# EAGLE design VS1053-PCB (EAGLE 7.7.0)
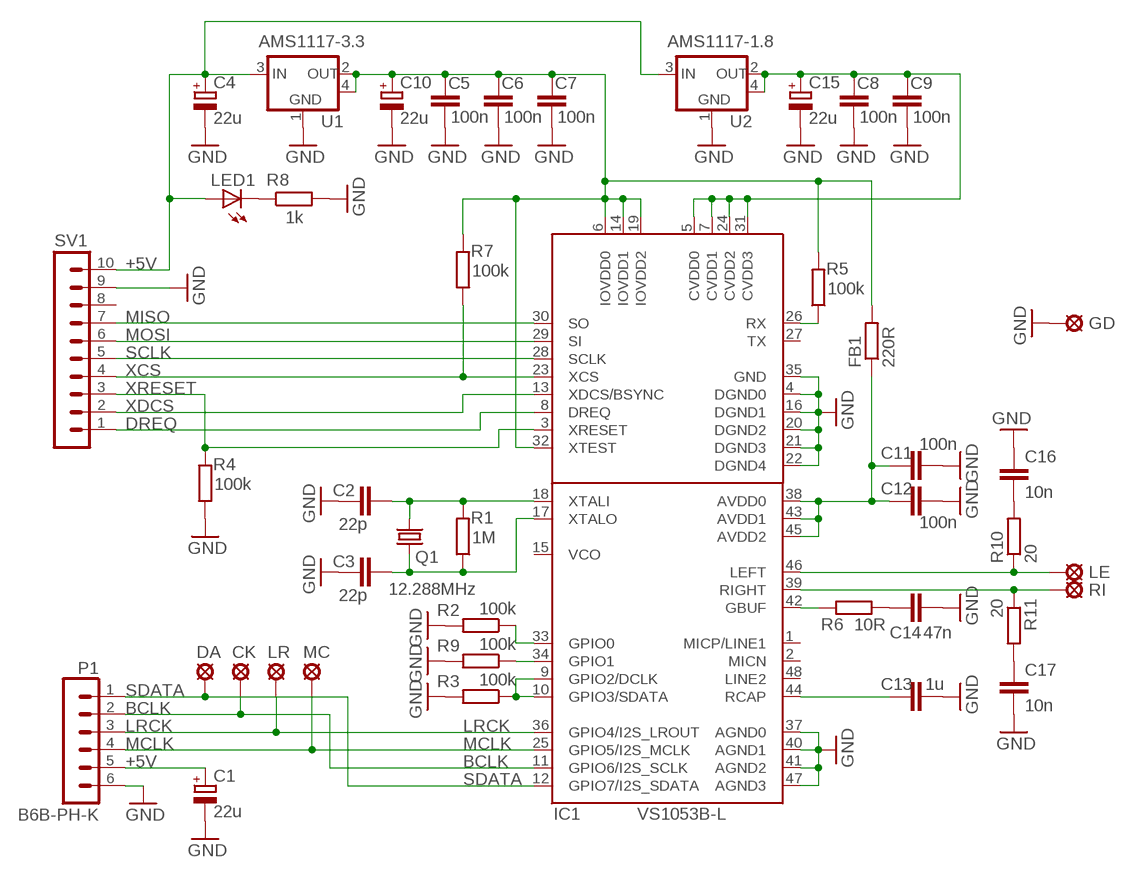
[diagram p0: schematic, sheet 1]

## Parts
C1  22u  CPOL-EUCT3528  [CT3528]
C2  22p  C-EUC0805  [C0805]
C3  22p  C-EUC0805  [C0805]
C4  22u  CPOL-EUCT3528  [CT3528]
C5  100n  C-EUC0805  [C0805]
C6  100n  C-EUC0805  [C0805]
C7  100n  C-EUC0805  [C0805]
C8  100n  C-EUC0805  [C0805]
C9  100n  C-EUC0805  [C0805]
C10  22u  CPOL-EUCT3528  [CT3528]
C11  100n  C-EUC0805  [C0805]
C12  100n  C-EUC0805  [C0805]
C13  1u  C-EUC0805  [C0805]
C14  47n  C-EUC0805  [C0805]
C15  22u  CPOL-EUCT3528  [CT3528]
C16  10n  C-EUC0603  [C0603]
C17  10n  C-EUC0603  [C0603]
CK  SOLPAD-MINI  [SOLPAD-MINI]
DA  SOLPAD-MINI  [SOLPAD-MINI]
FB1  220R  R-EU_R0805  [R0805]
GD  LSP10-ROUND  [LSP10-ROUND]
IC1  VS1053B-L  [QFP50P900X900X160-48N]
LE  LSP10-ROUND  [LSP10-ROUND]
LED1  LEDCHIPLED_0805  [CHIPLED_0805]
LR  SOLPAD-MINI  [SOLPAD-MINI]
MC  SOLPAD-MINI  [SOLPAD-MINI]
P1  B6B-PH-K  [B6B-PH-K]
Q1  12.288MHz  CRYSTALHC49S  [HC49/S]
R1  1M  R-EU_R0805  [R0805]
R2  100k  R-EU_R0805  [R0805]
R3  100k  R-EU_R0805  [R0805]
R4  100k  R-EU_R0805  [R0805]
R5  100k  R-EU_R0805  [R0805]
R6  10R  R-EU_R0805  [R0805]
R7  100k  R-EU_R0805  [R0805]
R8  1k  R-EU_R0805  [R0805]
R9  100k  R-EU_R0805  [R0805]
R10  20  R-EU_R0603  [R0603]
R11  20  R-EU_R0603  [R0603]
RI  LSP10-ROUND  [LSP10-ROUND]
SV1  MA10-1-THIN  [MA10-1-THIN]
U1  AMS1117-3.3  LT1117-S  [SOT223]
U2  AMS1117-1.8  LT1117-S  [SOT223]

## Nets
3.3VA: C11.1 C12.1 FB1.1 IC1.38(AVDD0) IC1.43(AVDD1) IC1.45(AVDD2)
+1.8V: C8.1 C9.1 C15.+ IC1.5(CVDD0) IC1.7(CVDD1) IC1.24(CVDD2) IC1.31(CVDD3) U2.2(OUT) U2.4(TAB)
+3.3V: C5.1 C6.1 C7.1 C10.+ FB1.2 IC1.6(IOVDD0) IC1.14(IOVDD1) IC1.19(IOVDD2) IC1.32(XTEST) R5.2 R7.2 U1.2(OUT) U1.4(TAB)
+5V: C1.+ C4.+ LED1.A P1.5 SV1.10 U1.3(IN) U2.3(IN)
BCLK: CK.1(SOLPAD) IC1.11(GPIO6/I2S_SCLK) P1.2
DREQ: IC1.8(DREQ) SV1.1
GND: C1.- C2.1 C3.1 C4.- C5.2 C6.2 C7.2 C8.2 C9.2 C10.- C11.2 C12.2 C13.2 C14.2 C15.- C16.1 C17.2 GD.MP(SOLPAD) IC1.4(DGND0) IC1.16(DGND1) IC1.20(DGND2) IC1.21(DGND3) IC1.22(DGND4) IC1.35(GND) IC1.37(AGND0) IC1.40(AGND1) IC1.41(AGND2) IC1.47(AGND3) P1.6 R2.2 R3.2 R4.1 R8.2 R9.2 SV1.9 U1.1(GND) U2.1(GND)
LRCK: IC1.36(GPIO4/I2S_LROUT) LR.1(SOLPAD) P1.3
MCLK: IC1.25(GPIO5/I2S_MCLK) MC.1(SOLPAD) P1.4
MISO: IC1.30(SO) SV1.7
MOSI: IC1.29(SI) SV1.6
N$1: C2.2 IC1.18(XTALI) Q1.2 R1.2
N$2: C3.2 IC1.17(XTALO) Q1.1 R1.1
N$3: IC1.9(GPIO2/DCLK) IC1.10(GPIO3/SDATA) R3.1
N$4: IC1.33(GPIO0) R2.1
N$5: IC1.42(GBUF) R6.1
N$6: C13.1 IC1.44(RCAP)
N$7: C14.1 R6.2
N$8: IC1.39(RIGHT) R11.1 RI.MP(SOLPAD)
N$9: IC1.26(RX) R5.1
N$10: IC1.46(LEFT) LE.MP(SOLPAD) R10.1
N$11: IC1.34(GPIO1) R9.1
N$12: LED1.C R8.1
N$13: C16.2 R10.2
N$14: C17.1 R11.2
SCLK: IC1.28(SCLK) SV1.5
SDATA: DA.1(SOLPAD) IC1.12(GPIO7/I2S_SDATA) P1.1
XCS: IC1.23(XCS) R7.1 SV1.4
XDCS: IC1.13(XDCS/BSYNC) SV1.2
XRESET: IC1.3(XRESET) R4.2 SV1.3
Unconnected: IC1.1(MICP/LINE1) IC1.2(MICN) IC1.15(VCO) IC1.27(TX) IC1.48(LINE2) SV1.8

## Library data of the parts
C1 C4 C10 C15 = rcl:CPOL-EU: POLARIZED CAPACITOR, European symbol
C2 C3 C5-C9 C11-C14 C16 C17 = rcl:C-EU: CAPACITOR, European symbol
CK DA LR MC = tj-library:SOLPAD-MINI
FB1 R1-R11 = rcl:R-EU_: RESISTOR, European symbol
GD LE RI = tj-library:LSP10-ROUND: SOLDER PAD round, drill 1.0 mm
IC1 = tj-library:VS1053B-L: VLSI, VS1053B-L 18bit-Audio Codec 48-Pin LQFP
LED1 = led:LED: LED OSRAM: - CHIPLED LG R971, LG N971, LY N971, LG Q971, LY Q971, LO R971, LY R971 LH N974, LH R974 LS Q976, LO Q976, LY Q976 LO Q996 - Hyper CHIPLED LW Q18S LB Q993, LB Q99A, LB R99A - SideLED LS A670, LO A670, LY A670, LG A670, LP A670 LB A673, LV A673, LT A673, LW A673 LH A674 LY A675 LS A676, LA A676, LO A676, LY A676, LW A676 LS A679, LY A679, LG A679 - Hyper Micro SIDELED® LS Y876, LA Y876, LO Y876, LY Y876 LT Y87S - SmartLED LW L88C, LW L88S LB L89C, LB L89S, LG L890 LS L89K, LO L89K, LY L89K LS L896, LA L896, LO L896, LY L896 - TOPLED LS T670, LO T670, LY T670, LG T670, LP T670 LSG T670, LSP T670, LSY T670, LOP T670, LYG T670 LG T671, LOG T671, LSG T671 LB T673, LV T673, LT T673, LW T673 LH T674 LS T676, LA T676, LO T676, LY T676, LB T676, LH T676, LSB T676, LW T676 LB T67C, LV T67C, LT T67C, LS T67K, LO T67K, LY T67K, LW E67C LS E67B, LA E67B, LO E67B, LY E67B, LB E67C, LV E67C, LT E67C LW T67C LS T679, LY T679, LG T679 LS T770, LO T770, LY T770, LG T770, LP T770 LB T773, LV T773, LT T773, LW T773 LH T774 LS E675, LA E675, LY E675, LS T675 LS T776, LA T776, LO T776, LY T776, LB T776 LHGB T686 LT T68C, LB T68C - Hyper Mini TOPLED® LB M676 - Mini TOPLED Santana® LG M470 LS M47K, LO M47K, LY M47K Source: http://www.osram.convergy.de LUXEON: - LUMILED® LXK2-PW12-R00, LXK2-PW12-S00, LXK2-PW14-U00, LXK2-PW14-V00 LXK2-PM12-R00, LXK2-PM12-S00, LXK2-PM14-U00 LXK2-PE12-Q00, LXK2-PE12-R00, LXK2-PE12-S00, LXK2-PE14-T00, LXK2-PE14-U00 LXK2-PB12-K00, LXK2-PB12-L00, LXK2-PB12-M00, LXK2-PB14-N00, LXK2-PB14-P00, LXK2-PB14-Q00 LXK2-PR12-L00, LXK2-PR12-M00, LXK2-PR14-Q00, LXK2-PR14-R00 LXK2-PD12-Q00, LXK2-PD12-R00, LXK2-PD12-S00 LXK2-PH12-R00, LXK2-PH12-S00 LXK2-PL12-P00, LXK2-PL12-Q00, LXK2-PL12-R00 Source: www.luxeon.com KINGBRIGHT: KA-3528ASYC Source: www.kingbright.com
P1 = tj-library:B6B-PH-K: JST PH2.0 Male HEADER 6-Pin
Q1 = crystal:CRYSTAL: CRYSTAL; OC_FARNELL: 1667008; OC_NEWARK: unknown
SV1 = tj-library:MA10-1-THIN: PIN HEADER
U1 U2 = v-reg:LT1117: 800mA LDO Positive Regulator Fixed 2.85V, 3.3V, 5V

## Net classes
0 default: width 0.254 mm, drill 0.305 mm, clearance 0.152 mm

## Board
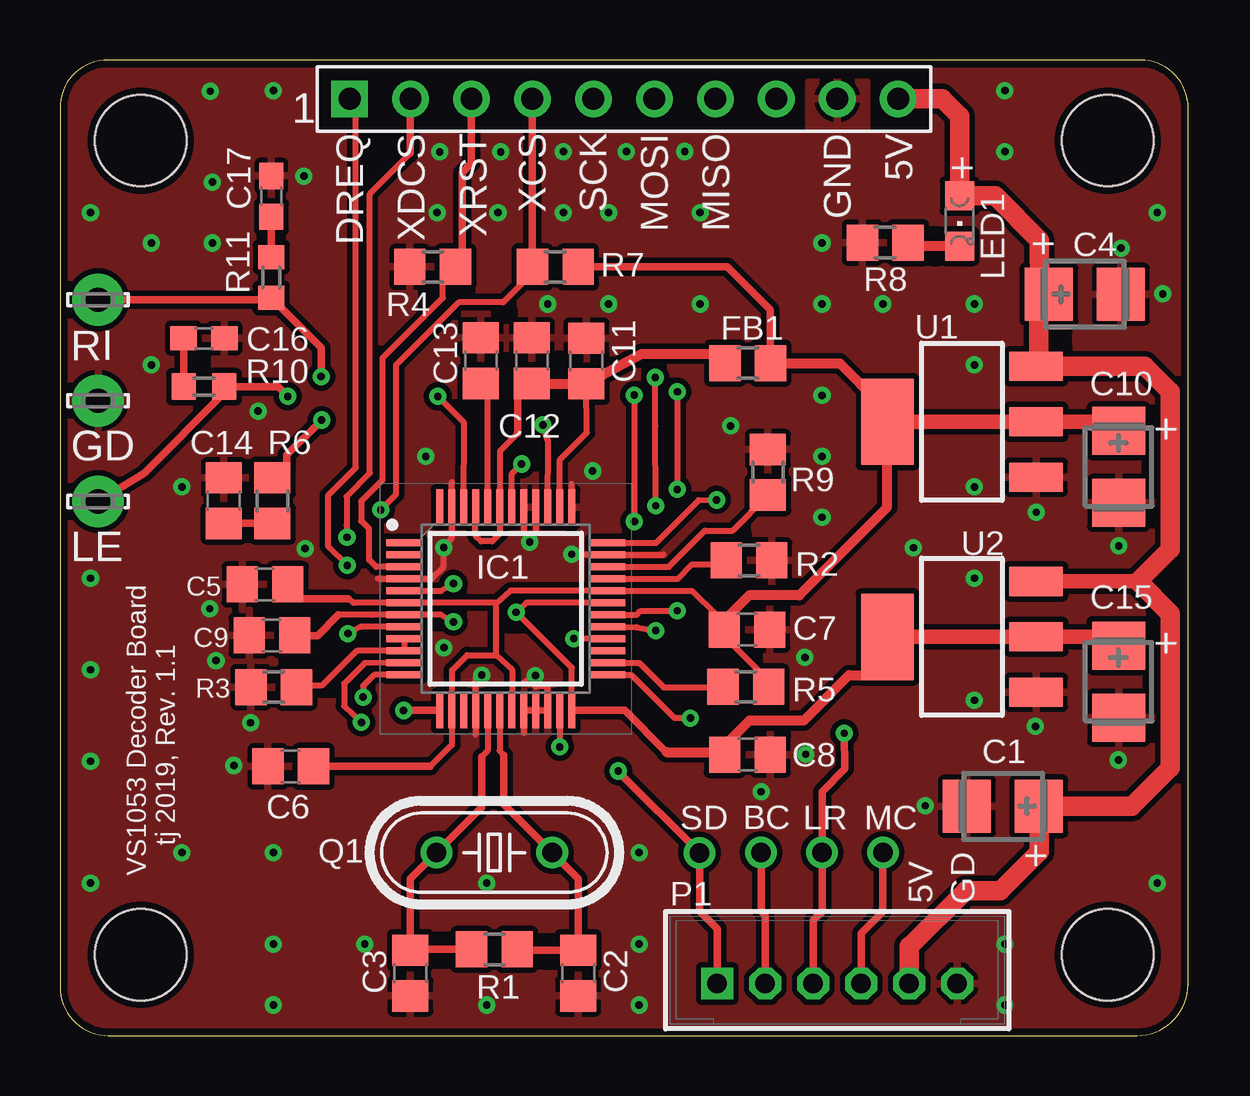
[diagram p1: board, top side]
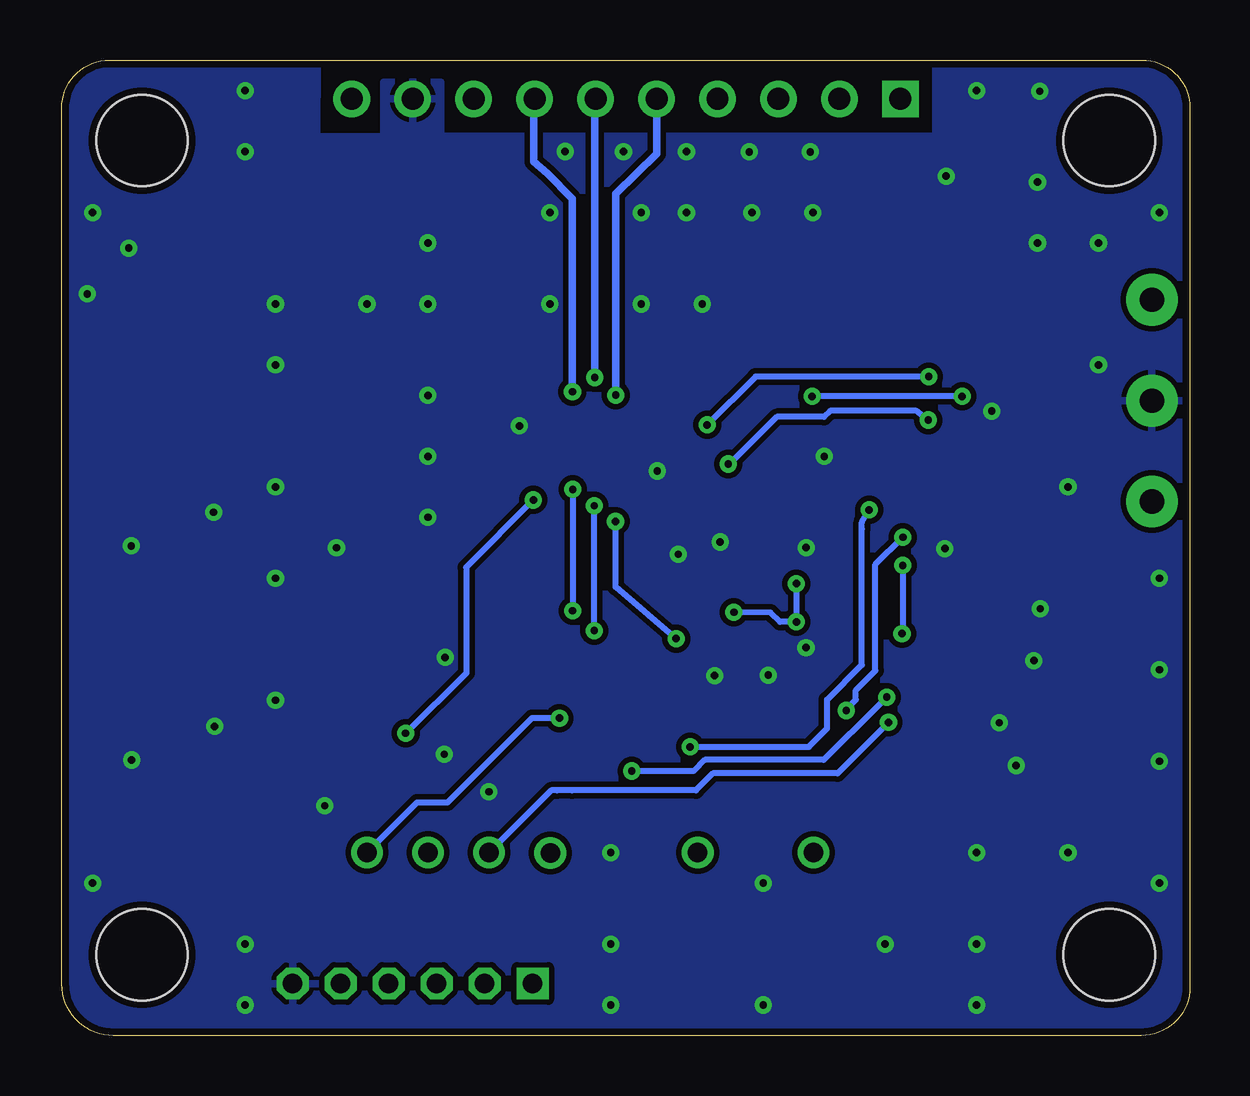
[diagram p2: board, bottom side, seen from below]

Size 47 x 40.65 mm. Coordinates in mm from the lower left corner, seen from the top.
Outline: 47,2.14 47,38.83 arc90 44.83,40.64 2.18,40.64 arc90 0,38.82 0,2.02 arc90 2.02,0 44.86,0 arc90 47,2.14
Copper layers (1*16): Top 0.035mm / dielectric 1.5mm / Bottom 0.035mm
Design rules "default *": minimum track width 8mil, minimum drill 12mil, track to track 6mil, track to pad 6mil, pad to pad 6mil, via to via 8mil, smd to smd 6mil, copper to edge 12mil, drill to drill 8mil, minimum pad ring 10mil, minimum via ring 8mil, stop-mask expansion 4mil, vias tented up to drill 12mil, thermal gap 8mil
Holes 3.81 mm at 3.37,3.37 43.66,3.37 3.37,37.29 43.66,37.29
tRestrict: area 45.3,14.3 to 45.5,15.1; area 45.3,23.3 to 45.5,24.1; area 18.2,29.9 to 18.9,30.2; area 20.5,27.9 to 21.6,28.3; area 15.1,30.5 to 15.2,31.1; area 36.3,33.4 to 36.6,33.5; area 36.3,32.3 to 36.6,32.4; area 41.8,28.7 to 42,29.3; area 15.4,17.1 to 15.8,17.2; area 18.7,17 to 19.2,17.1; area 29,15.7 to 29.1,15.9; area 28.5,20.8 to 28.6,20.9; 10 more areas

### Footprints (pad centres in the part's own frame; a part is rotated, then mirrored left to right if it is on the bottom)
CT3528 = smd 2 x 2.2: + -1.5,0; - 1.5,0
C0805 = smd 1.3 x 1.5: 1 -0.95,0; 2 0.95,0
C0603 = smd 1.1 x 1: 1 -0.85,0; 2 0.85,0
SOLPAD-MINI = drill 0.813: 1 0,0
R0805 = smd 1.3 x 1.5: 1 -0.95,0; 2 0.95,0
LSP10-ROUND = drill 1.016 pad 2.159: MP 0,0
QFP50P900X900X160-48N = smd 1.475 x 0.3: 1 -4.238,2.75; 2 -4.238,2.25; 3 -4.238,1.75; 4 -4.238,1.25; 5 -4.238,0.75; 6 -4.238,0.25; 7 -4.238,-0.25; 8 -4.238,-0.75; 9 -4.238,-1.25; 10 -4.238,-1.75; 11 -4.238,-2.25; 12 -4.238,-2.75; 25 4.238,-2.75; 26 4.238,-2.25; 27 4.238,-1.75; 28 4.238,-1.25; 29 4.238,-0.75; 30 4.238,-0.25; 31 4.238,0.25; 32 4.238,0.75; 33 4.238,1.25; 34 4.238,1.75; 35 4.238,2.25; 36 4.238,2.75 | smd 0.3 x 1.475: 13 -2.75,-4.238; 14 -2.25,-4.238; 15 -1.75,-4.238; 16 -1.25,-4.238; 17 -0.75,-4.238; 18 -0.25,-4.238; 19 0.25,-4.238; 20 0.75,-4.238; 21 1.25,-4.238; 22 1.75,-4.238; 23 2.25,-4.238; 24 2.75,-4.238; 37 2.75,4.238; 38 2.25,4.238; 39 1.75,4.238; 40 1.25,4.238; 41 0.75,4.238; 42 0.25,4.238; 43 -0.25,4.238; 44 -0.75,4.238; 45 -1.25,4.238; 46 -1.75,4.238; 47 -2.25,4.238; 48 -2.75,4.238
CHIPLED_0805 = smd 1.2 x 1.2: A 0,-1.05; C 0,1.05
B6B-PH-K = drill 0.813 square: 1 -6.27,0 | drill 0.813 octagon: 2 -4.27,0; 3 -2.27,0; 4 -0.27,0; 5 1.73,0; 6 3.73,0
HC49/S = drill 0.813: 1 -2.413,0; 2 2.413,0
R0603 = smd 1 x 1.1: 1 -0.85,0; 2 0.85,0
MA10-1-THIN = drill 0.914 pad 1.524 square: 1 -10.16,0 | drill 0.914 pad 1.524: 2 -7.62,0; 3 -5.08,0; 4 -2.54,0; 5 0,0; 6 2.54,0; 7 5.08,0; 8 7.62,0; 9 10.16,0; 10 12.7,0
SOT223 = smd 1.219 x 2.235: 1 -2.311,-3.099; 2 0,-3.099; 3 2.311,-3.099 | smd 3.6 x 2.2: 4 0,3.099

### Placement (x,y rotation side)
C1  39.29,9.55 180 top
C2  21.59,2.6 90 top
C3  14.59,2.6 90 top
C4  42.71,30.89 0 top
C5  8.54,18.79 180 top
C6  9.62,11.21 180 top
C7  28.62,16.91 0 top
C8  28.65,11.7 0 top
C9  8.83,16.67 180 top
C10  44.11,23.69 270 top
C11  21.93,28.11 90 top
C12  19.66,28.12 90 top
C13  17.54,28.12 90 top
C14  6.83,22.28 90 top
C15  44.11,14.74 270 top
C16  6,29.05 180 top
C17  8.81,34.96 90 top
CK  29.21,7.62 0 top
DA  26.65,7.61 0 top
FB1  28.66,28.02 0 top
GD  1.58,26.45 0 top
IC1  18.57,17.78 0 top
LE  1.58,22.25 0 top
LED1  37.49,33.93 180 top
LR  31.75,7.62 0 top
MC  34.29,7.62 0 top
P1  33.66,2.16 0 top
Q1  18.1,7.62 0 top
R1  18.1,3.59 0 top
R2  28.71,19.79 0 top
R3  8.91,14.52 180 top
R4  15.53,32.02 0 top
R5  28.57,14.53 0 top
R6  8.85,22.28 270 top
R7  20.64,32.03 0 top
R8  34.39,33.04 180 top
R9  29.49,23.47 90 top
R10  6,27.03 180 top
R11  8.8,31.58 90 top
RI  1.58,30.66 0 top
SV1  22.23,39.03 0 top
U1  37.57,25.57 90 top
U2  37.57,16.61 90 top

### Tracks (layer width: path | path; a pad name or v marks a point on that pad's centre or on a via)
3.3VA
  Top 0.254: IC1.43 | IC1.43 18.32,20.91 18.01,20.59 17.54,20.59 17.31,20.82 17.31,22.01 IC1.45 | IC1.43 18.32,24.34 19.07,25.1 | 19.07,26.65 19.66,27.11 C12.1 | IC1.38 20.82,23.99 21.95,25.12 C11.1
  Top 0.305: 19.07,25.1 19.07,26.65
  Top 0.406: 22.29,27.28 22.54,27.49 | C12.1 19.67,27.16 C11.1 22.19,27.25 22.54,27.49 | 22.54,27.49 24.24,28.4 27.27,28.4 27.68,27.82 FB1.1
+1.8V  (via drill 0.3)
  Top 0.254: IC1.5 15.87,18.53 v16.39,18.83 | v16.39,17.23 15.87,17.54 IC1.7 13.02,17.53 13.01,17.53 11.6,17.53 | 35.15,16.5 U2.4 | IC1.24 21.32,15.33 v19,17.63 19.42,18.03 IC1.31 | 9.88,16.66 C9.1 | 28.02,11.82 C8.1
  Top 0.305: 11.6,17.53 10.74,16.66 9.88,16.66 | IC1.24 23.53,13.54 25.26,11.81
  Top 0.406: 34.85,16.5 U2.4 | U2.4 | 34.44,15.52 34.46,15.5 | 34.46,16.6 U2.4 | 25.26,11.81 27.65,11.81 C8.1 27.96,11.9 27.93,12.32 28.73,13.12 30.98,13.12 32.87,15.02 33.86,15.02 34.36,15.52 34.44,15.52 | 34.44,15.52 34.48,15.55 U2.4
  Top 0.61: C15.+ 43.87,16.24 43.49,16.62 U2.2 35.26,16.61 35.15,16.5
  Bottom 0.254: v16.39,18.83 v16.39,17.23 17.08,17.23 17.47,17.62 v19,17.63
+3.3V
  Top 0.254: 15.43,11.22 16.33,12.11 IC1.14 16.33,15.23 16.96,15.85 18.17,15.85 | IC1.19 18.83,15.23 18.17,15.85 | 18.15,18 18.77,18.54 IC1.32 26.33,18.53 27.36,17.5 27.88,17.5 | 18.15,18 18.15,15.86 18.17,15.85 | 18.15,18 18.19,18.03 IC1.6 12.23,18.03 12.02,18.2 | R5.2 29.45,14.86 28.05,16.27 28.05,16.53 C7.1
  Top 0.305: 15.43,11.22 C6.1 | R7.2 27.8,32.03 29.6,30.23 FB1.2 | 12.02,18.2 10.08,18.2 C5.1
  Top 0.406: C7.1 27.88,17.12 27.88,17.5 28.71,18.34 30.81,18.34 34.47,22.02 U1.4 34.1,25.95 34.1,26.39 32.49,28.01 FB1.2 | 29.61,27.83 FB1.2 | FB1.2
  Top 0.61: C10.+ 43.81,25.19 43.44,25.56 40.68,25.56 U1.2 U1.4
+5V
  Top 0.254: 35.38,3.71 35.41,3.71
  Top 0.61: U2.3 44.92,18.93
  Top 0.813: SV1.10 36.75,39.03 37.48,38.3 37.49,36.32 LED1.A 38.97,34.98 40.8,33.13 40.81,31.19 C4.+ 40.78,30.47 40.78,27.99 U1.3 45.2,27.88 46.26,26.83 46.27,20.27 44.92,18.93 46.26,17.57 46.26,11.15 44.66,9.55 C1.+ 40.8,9.54 40.8,7.66 39.17,6.03 37.73,6.03 35.41,3.71 | P1.5 35.38,3.71
BCLK  (via drill 0.3)
  Top 0.254: IC1.11 12.69,15.52 11.84,14.66 11.84,13.73 v12.56,13.04 | 29.39,2.32 P1.2
  Top 0.305: CK.1 29.21,5.17 29.39,4.99 29.39,2.32
  Bottom 0.254: v12.56,13.04 12.64,12.96 14.65,10.95 14.65,10.94 14.67,10.92 19.88,10.92 20.58,10.22 25.76,10.22 26.38,10.22 26.61,10.22 CK.1
DREQ  (via drill 0.3)
  Top 0.254: IC1.8 12.5,17.03 v12,16.75 | SV1.1 12.33,38.59 12.33,23.66 11.16,22.5 11.16,20.39 v11.97,19.59
  Bottom 0.254: v11.97,19.59 11.97,16.81 v12,16.75
GND  (via drill 0.3)
  Top 0.254: IC1.40 19.82,20.98 v19.58,20.56 19.32,20.99 IC1.41 | v17.57,15.02 17.32,14.91 IC1.16 17.32,12.55 | 19.32,14.71 v19.81,15 19.81,14.54 20.32,14.54 | 25.14,20.04 22.82,20.04 IC1.35 v21.32,20.04 v21.32,20.05 | 21.32,22.98 IC1.37 | 13.24,19.03 IC1.4 15.49,19.03 15.98,19.52 v15.99,20.33 16.32,20.75 IC1.47 16.32,23.06 | 19.32,12.61 IC1.20 IC1.21 IC1.22 20.32,13.97 20.32,14.54 | 20.32,14.54
  other vias: 8.25,26.01 31.75,24.13 35.56,20.32 16,16.16 31.75,30.48 6.24,17.78 7.94,13.03 29.21,10.16 8.89,1.27 36.05,9.57 40.68,21.8 44.1,11.48 6.35,33.02 15.24,24.13 27.94,25.4 31.07,11.72 20.98,36.83 23.6,36.83 34.29,30.48 31.75,21.59 38.1,30.48 5.08,7.62 7.24,11.25 6.5,15.62 10.16,35.81 6.26,39.34 1.27,19.05 39.37,39.37 1.27,6.35 39.37,3.81 40.64,12.88 45.72,34.29 44.11,20.4 31.75,33.02 8.89,7.62 8.89,3.81 12.7,3.81 17.78,1.27 24.13,3.81 26.67,34.29 39.37,36.83 38.1,27.94 38.1,22.86 38.1,19.05 38.1,13.97 45.72,6.35 44.21,32.81 24.13,1.27 39.37,1.27 6.35,35.56 8.89,39.37 3.81,33.02 1.27,34.29 1.27,11.43 1.27,15.24 5.08,22.86 31.04,15.76 15.82,36.82 10.21,20.29 15.71,34.29 20.32,30.48 45.95,30.9 22.19,23.52 3.81,27.94 22.86,30.48 26.03,36.83 22.86,34.29 20.98,34.29 26.67,30.48 18.36,36.82 18.25,34.29 17.78,6.35 24.13,7.62 31.75,26.67
  pour Bottom (isolate 0.229): 0,0 46.99,0 46.99,40.64 36.36,40.66 36.38,37.46 34.31,37.46 33.59,37.45 33.59,39.73 32.16,39.73 31.38,39.72 31.21,39.71 31.21,37.48 10.59,37.46 10.6,40.62 0,40.64
  pour Top (isolate 0.229): 0,0 46.99,0 46.99,40.64 36.37,40.66 36.38,37.46 33.61,37.45 33.61,39.73 31.2,39.72 31.19,37.46 10.59,37.45 10.6,40.63 0,40.64
LRCK  (via drill 0.3)
  Top 0.254: IC1.36 24.84,20.53 26.61,22.3 v27.36,22.31 | 31.39,2.32 P1.3
  Top 0.305: v32.68,12.59 32.69,11.11 31.75,10.15 LR.1 31.75,5.16 31.39,4.8 31.39,2.32
  Bottom 0.254: v32.68,12.59 30.15,15.1 30.16,19.51 v27.36,22.31
MCLK  (via drill 0.3)
  Top 0.254: 33.4,2.33 P1.4 | IC1.25 23.8,15.03 25.59,13.23 v26.26,13.23 v26.27,13.22
  Top 0.305: MC.1 34.29,5.15 33.4,4.26 33.4,2.33
  Bottom 0.254: v26.27,13.22 27.42,13.22 30.94,9.7 32.21,9.7 MC.1
MISO  (via drill 0.3)
  Top 0.254: v25.73,26.82 v25.72,22.76 | IC1.30 24.02,17.53 24.18,17.69 v25.72,17.7
  Bottom 0.254: v25.72,22.76 v25.72,17.7
  Bottom 0.305: SV1.7 27.34,38.23 27.35,36.41 26.78,35.92 25.73,34.86 v25.73,26.82
MOSI  (via drill 0.3)
  Top 0.254: v24.82,22.07 24.81,25.4 v24.8,27.42 | IC1.29 24.01,17.02 v24.82,16.87
  Bottom 0.254: v24.82,16.87 24.82,22.09 v24.82,22.07
  Bottom 0.305: SV1.6 24.79,38.23 24.79,36.72 24.79,27.4 v24.8,27.42
N$1
  Top 0.254: IC1.18 18.32,11.87 18.5,11.69
  Top 0.305: R1.2 19.05,3.55 C2.2 21.59,6.54 Q1.2 | 20.5,7.62 Q1.2 | 18.5,11.69 18.5,9.63 Q1.2
N$2
  Top 0.254: IC1.17 17.82,11.86 17.58,11.62
  Top 0.305: R1.1 14.62,3.6 C3.2 14.6,6.53 Q1.1 17.58,9.52 17.58,11.62
N$3
  Top 0.254: IC1.9 IC1.10 12.36,16.03 10.9,14.57 9.86,14.57 R3.1
N$4
  Top 0.254: IC1.33 25.73,19.03 26.33,19.63 27.52,19.63 R2.1
N$5  (via drill 0.3)
  Top 0.254: IC1.42 18.82,23.4 v19.23,23.81 | 9.22,23.1 R6.1
  Top 0.305: v10.9,25.64 9.45,24.2 9.45,23.65 9.42,23.62 9.24,23.62 R6.1
  Bottom 0.254: v10.9,25.64 11.4,26.03 15,26.03 15.25,25.78 17.21,25.78 19.17,23.81 v19.23,23.81
N$6
  Top 0.254: IC1.44 17.82,26.88 C13.1
N$7
  Top 0.305: R6.2 C14.1
N$8  (via drill 0.3)
  Top 0.254: IC1.39 20.33,24.77 v20.12,25.44
  Top 0.305: 8.73,30.8 R11.1 | 8.81,30.75 R11.1 | v10.88,27.46 10.88,28.66 R11.1 | RI.MP 8.8,30.66 R11.1
  Bottom 0.254: v10.88,27.46 18.1,27.46 v20.12,25.44
N$9
  Top 0.254: IC1.26 24.12,15.53 25.15,14.5 27.95,14.5 R5.1
N$10  (via drill 0.3)
  Top 0.254: IC1.46 16.83,25.54 v15.74,26.63
  Top 0.305: v9.49,26.63 9.09,27.04 R10.1 6.85,26.78 3.5,23.43 LE.MP
  Bottom 0.254: v9.49,26.63 v15.74,26.63
N$11
  Top 0.254: IC1.34 25.37,19.53 26.87,21.04 28.03,21.04 R9.1
N$12
  Top 0.254: 35.39,32.88 R8.1
  Top 0.406: LED1.C 35.39,32.88
N$13
  Top 0.305: 5.16,29.1 C16.2 R10.2
N$14
  Top 0.305: C17.1 8.81,32.44 R11.2
SCLK  (via drill 0.3)
  Top 0.254: v23.92,26.68 v23.93,21.42 | IC1.28 v21.41,16.54
  Bottom 0.254: v23.93,21.42 23.93,18.69 v21.41,16.54
  Bottom 0.305: SV1.5 22.23,36.75 23.93,35.07 23.92,30.8 v23.92,26.68
SDATA  (via drill 0.3)
  Top 0.254: IC1.12 13.1,15.03 12.63,14.56 v12.63,14.1 | v23.26,11.02 23.26,11 | 27.39,2.32 P1.1
  Top 0.305: 23.26,11 DA.1 26.65,5.17 27.39,4.44 27.39,2.32
  Bottom 0.254: v12.63,14.1 12.98,13.75 15.26,11.48 20.21,11.48 20.68,11.01 v23.25,11.01 v23.26,11.02
XCS  (via drill 0.3)
  Top 0.254: IC1.23 v20.82,12.03 | 19.79,32.53 R7.1 | 19.68,32.67 R7.1 | v13.37,21.9 14.01,22.55 14.01,27.94 16.62,30.55 18.46,30.55 19.67,31.75 R7.1
  Top 0.305: SV1.4 19.68,32.67
  Bottom 0.254: v20.82,12.03 15.88,12.03 15.12,12.79 15.12,13.99 13.67,15.44 13.67,21.1 13.67,21.38 v13.37,21.9
XDCS  (via drill 0.3)
  Top 0.254: v14.32,13.54 14.29,13.52 | 14.6,36.77 12.91,35.07 12.91,23.44 11.95,22.46 11.95,21.27 11.95,20.76 v11.96,20.76
  Top 0.305: IC1.13 v14.32,13.54 | 14.6,36.77 14.6,38.26 SV1.2
  Bottom 0.254: v14.32,13.54 14.32,13.59 13.92,13.99 13.92,14.39 13.1,15.21 13.1,19.63 v11.96,20.76
XRESET
  Top 0.254: IC1.3 13.17,19.53 12.88,19.82 12.88,21.11 12.55,21.44 12.55,22.25 13.45,23.15 13.45,28.23 15.95,30.74 15.95,31.5 R4.2
  Top 0.305: SV1.3 17.14,36.34 16.76,35.95 16.76,32.3 R4.2

### Text on the board
tPlace: DREQ | XDCS | XRST | XCS | SCK | MOSI | MISO | GND | 5V | + | + | + | + | SD | BC | LR | MC | VS1053 Decoder Board / tj 2019, Rev. 1.1 | + | 5V | GD